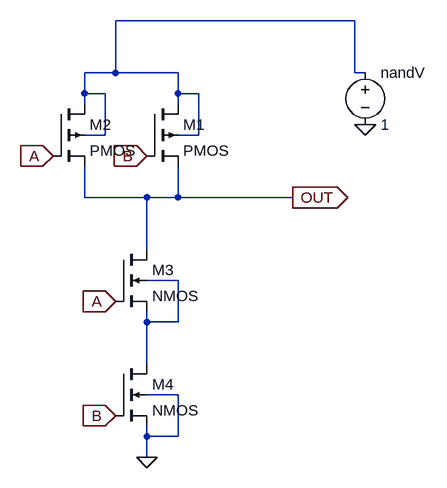
[diagram p0: schematic Draft5.asc]
Draft5.asc, the LTspice schematic file:
Version 4
SHEET 1 880 680
WIRE 576 -64 208 -64
WIRE 208 16 208 -64
WIRE 208 16 160 16
WIRE 304 16 208 16
WIRE 576 16 576 -64
WIRE 592 16 576 16
WIRE 160 48 160 16
WIRE 192 48 160 48
WIRE 304 48 304 16
WIRE 336 48 304 48
WIRE 160 64 160 48
WIRE 304 64 304 48
WIRE 192 112 192 48
WIRE 192 112 160 112
WIRE 336 112 336 48
WIRE 336 112 304 112
WIRE 160 208 160 160
WIRE 256 208 160 208
WIRE 304 208 304 160
WIRE 304 208 256 208
WIRE 480 208 304 208
WIRE 256 288 256 208
WIRE 304 336 256 336
WIRE 256 400 256 384
WIRE 304 400 304 336
WIRE 304 400 256 400
WIRE 256 464 256 400
WIRE 304 512 256 512
WIRE 256 576 256 560
WIRE 304 576 304 512
WIRE 304 576 256 576
WIRE 256 608 256 576
FLAG 256 608 0
FLAG 208 544 B
IOPIN 208 544 In
FLAG 112 144 A
IOPIN 112 144 In
FLAG 256 144 B
IOPIN 256 144 In
FLAG 208 368 A
IOPIN 208 368 In
FLAG 480 208 OUT
IOPIN 480 208 Out
FLAG 592 96 0
SYMBOL pmos4 256 64 R0
SYMATTR InstName M1
SYMATTR Value2 l=32n w=64n
SYMBOL pmos4 112 64 R0
SYMATTR InstName M2
SYMATTR Value2 l=32n w=64n
SYMBOL nmos4 208 288 R0
SYMATTR InstName M3
SYMBOL nmos4 208 464 R0
SYMATTR InstName M4
SYMBOL voltage 592 0 R0
SYMATTR InstName nandV
SYMATTR Value 1

The netlist it stands for:
* Draft5.asc
M1 N001 B OUT N001 PMOS l=32n w=64n
M2 N001 A OUT N001 PMOS l=32n w=64n
M3 OUT A N002 N002 NMOS
M4 N002 B 0 0 NMOS
V§nandV N001 0 1
.model NMOS NMOS
.model PMOS PMOS
.lib standard.mos
.backanno
.end